# Altium schematic sheet PCB Esquematic.SchDoc
size A1
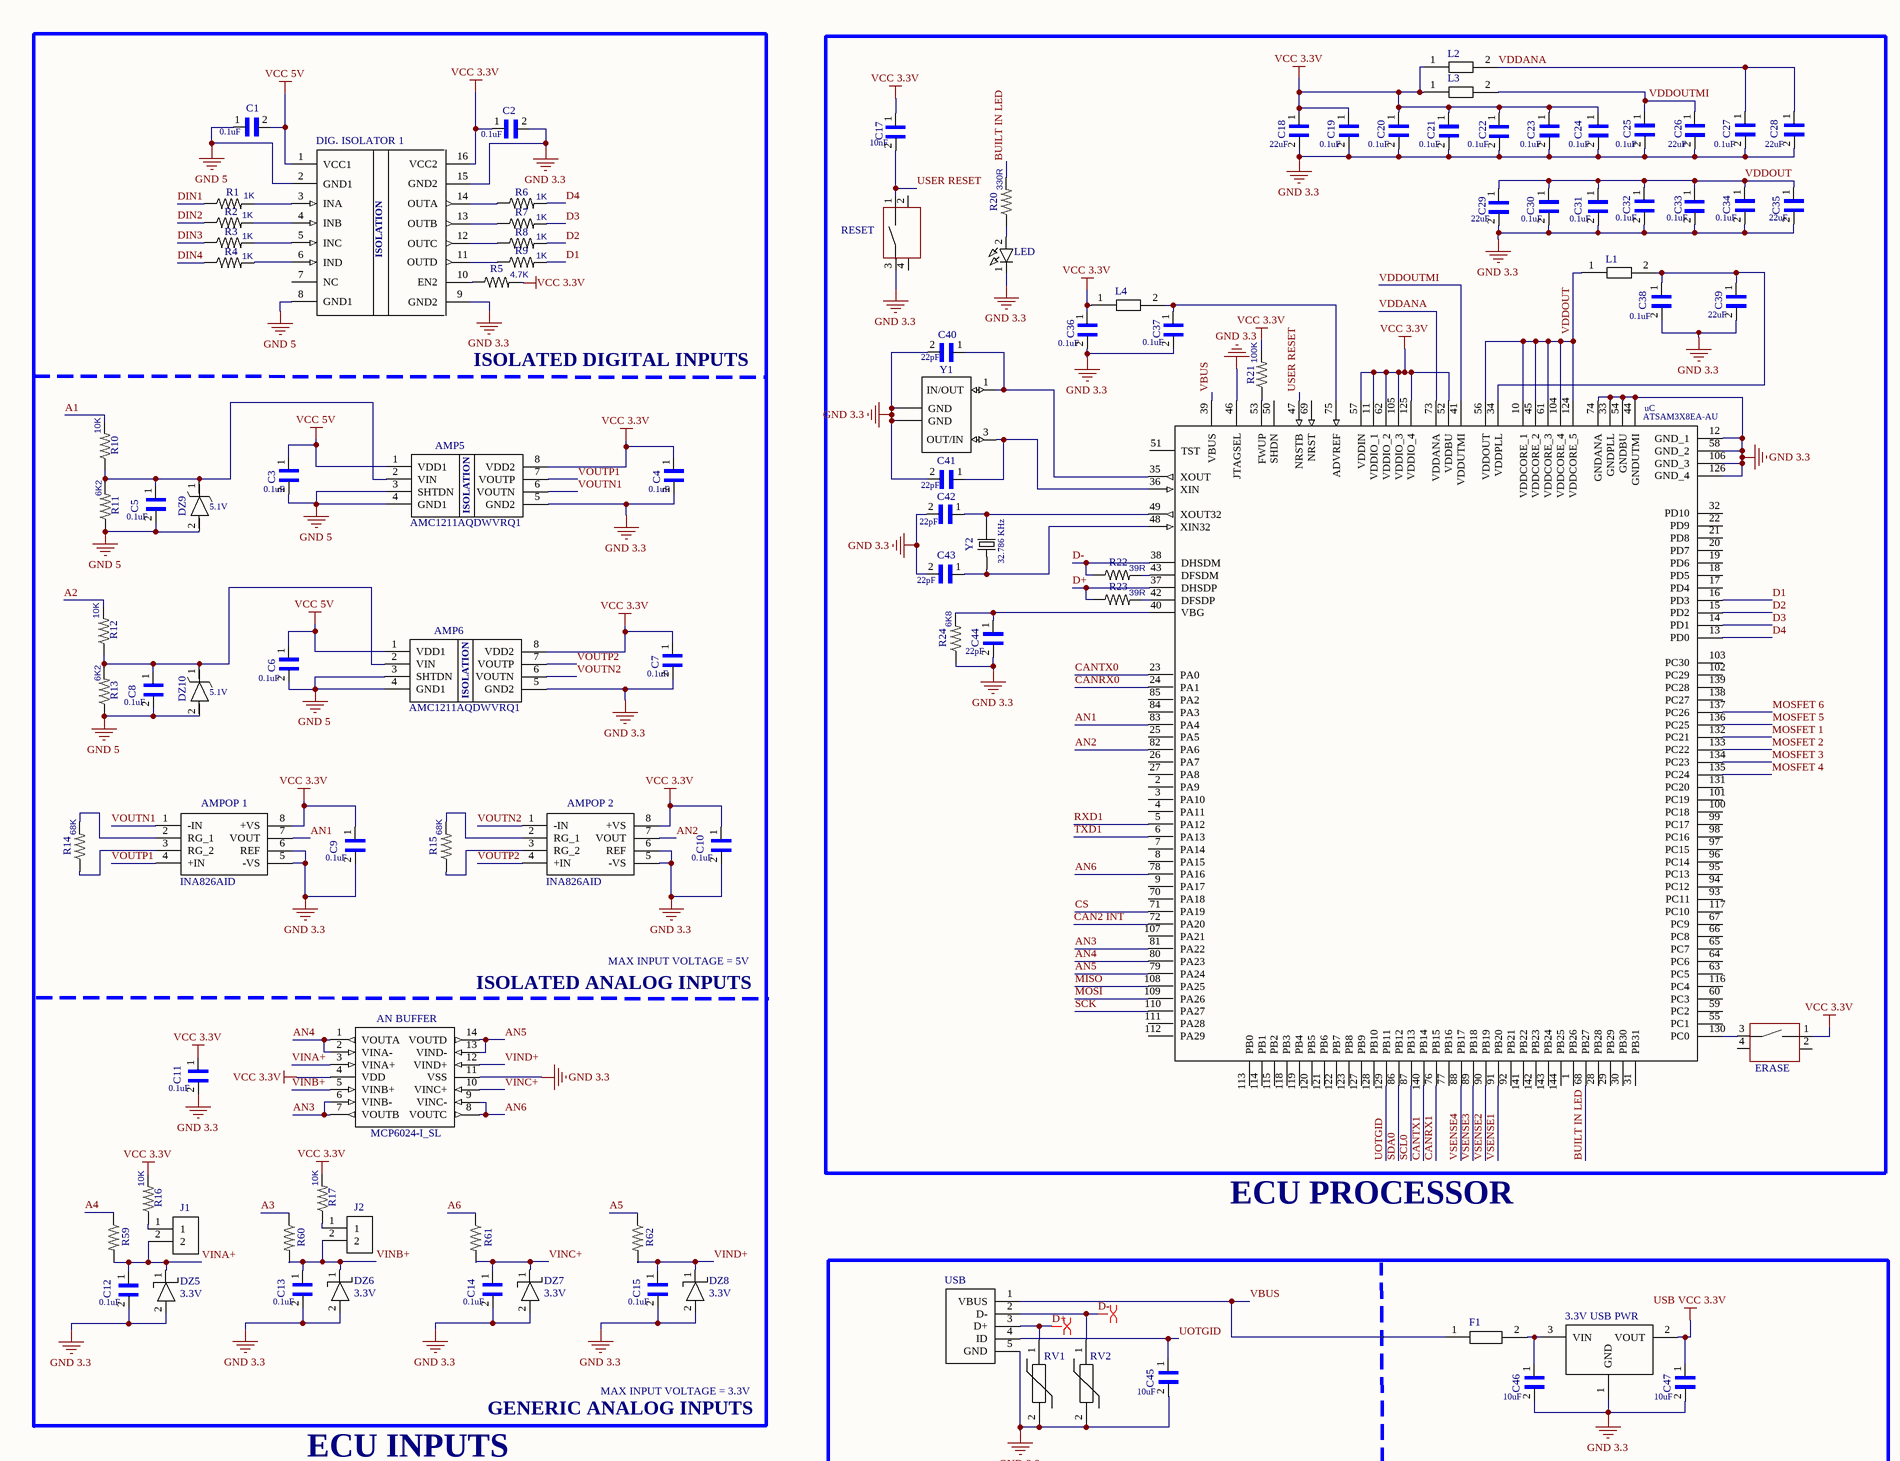
[diagram p0: PCB Esquematic.SchDoc, top left]
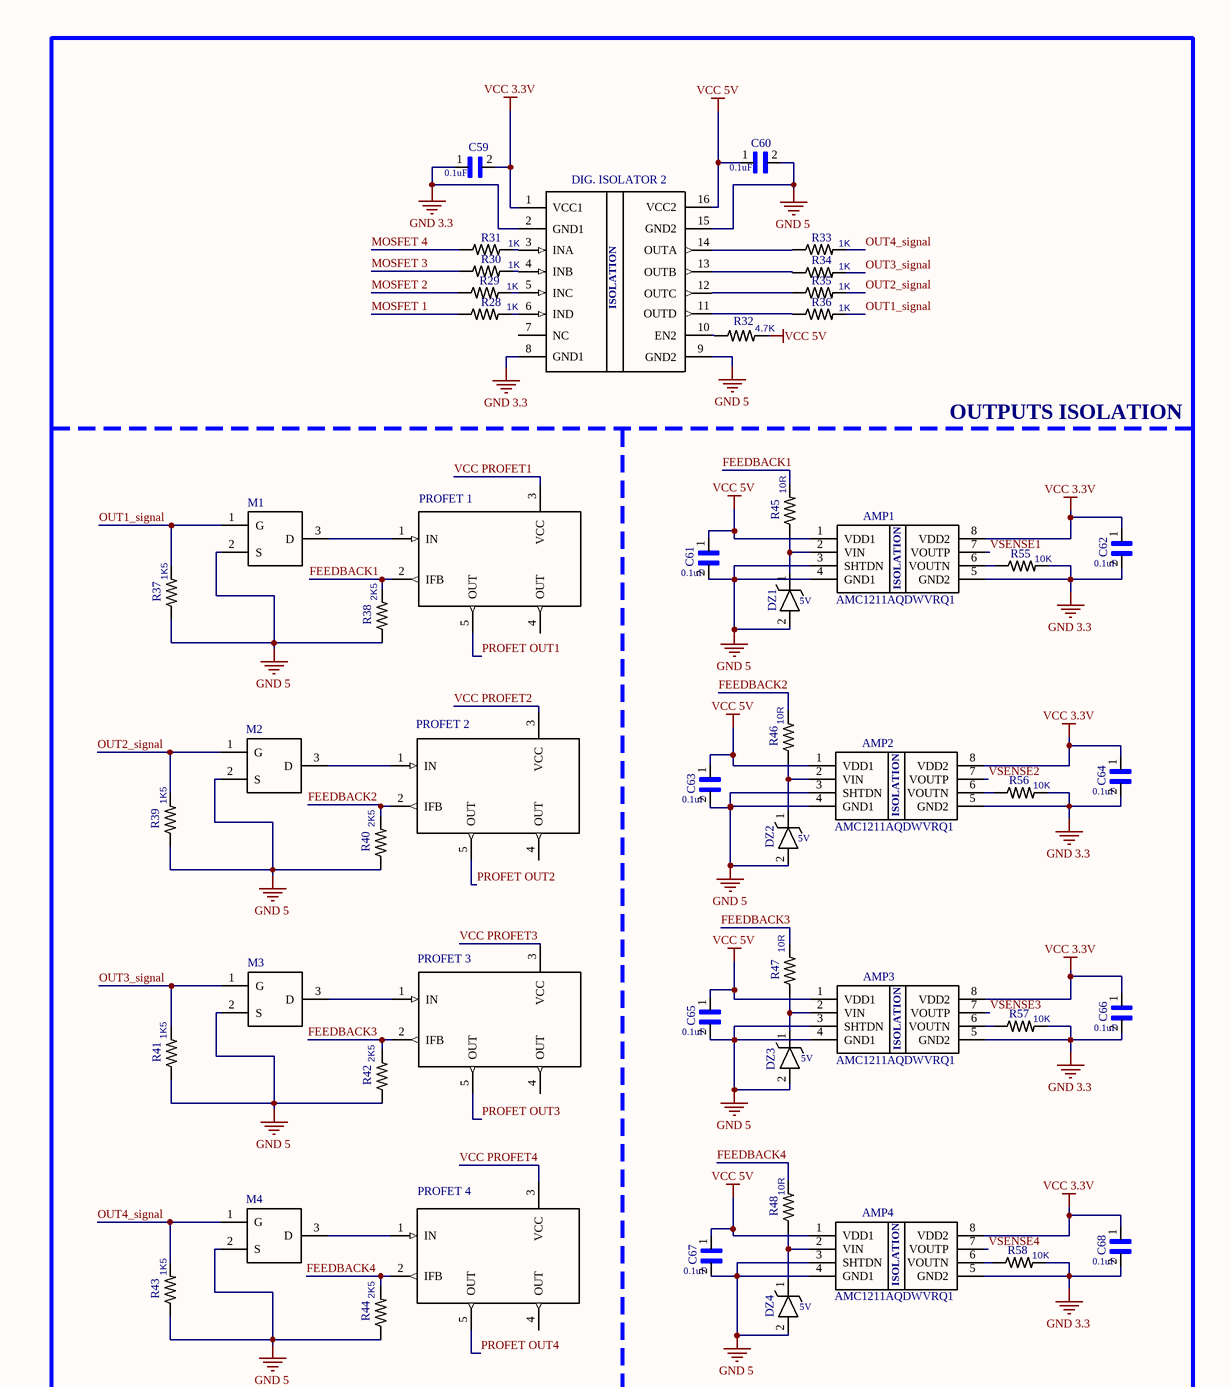
[diagram p1: PCB Esquematic.SchDoc, top right]
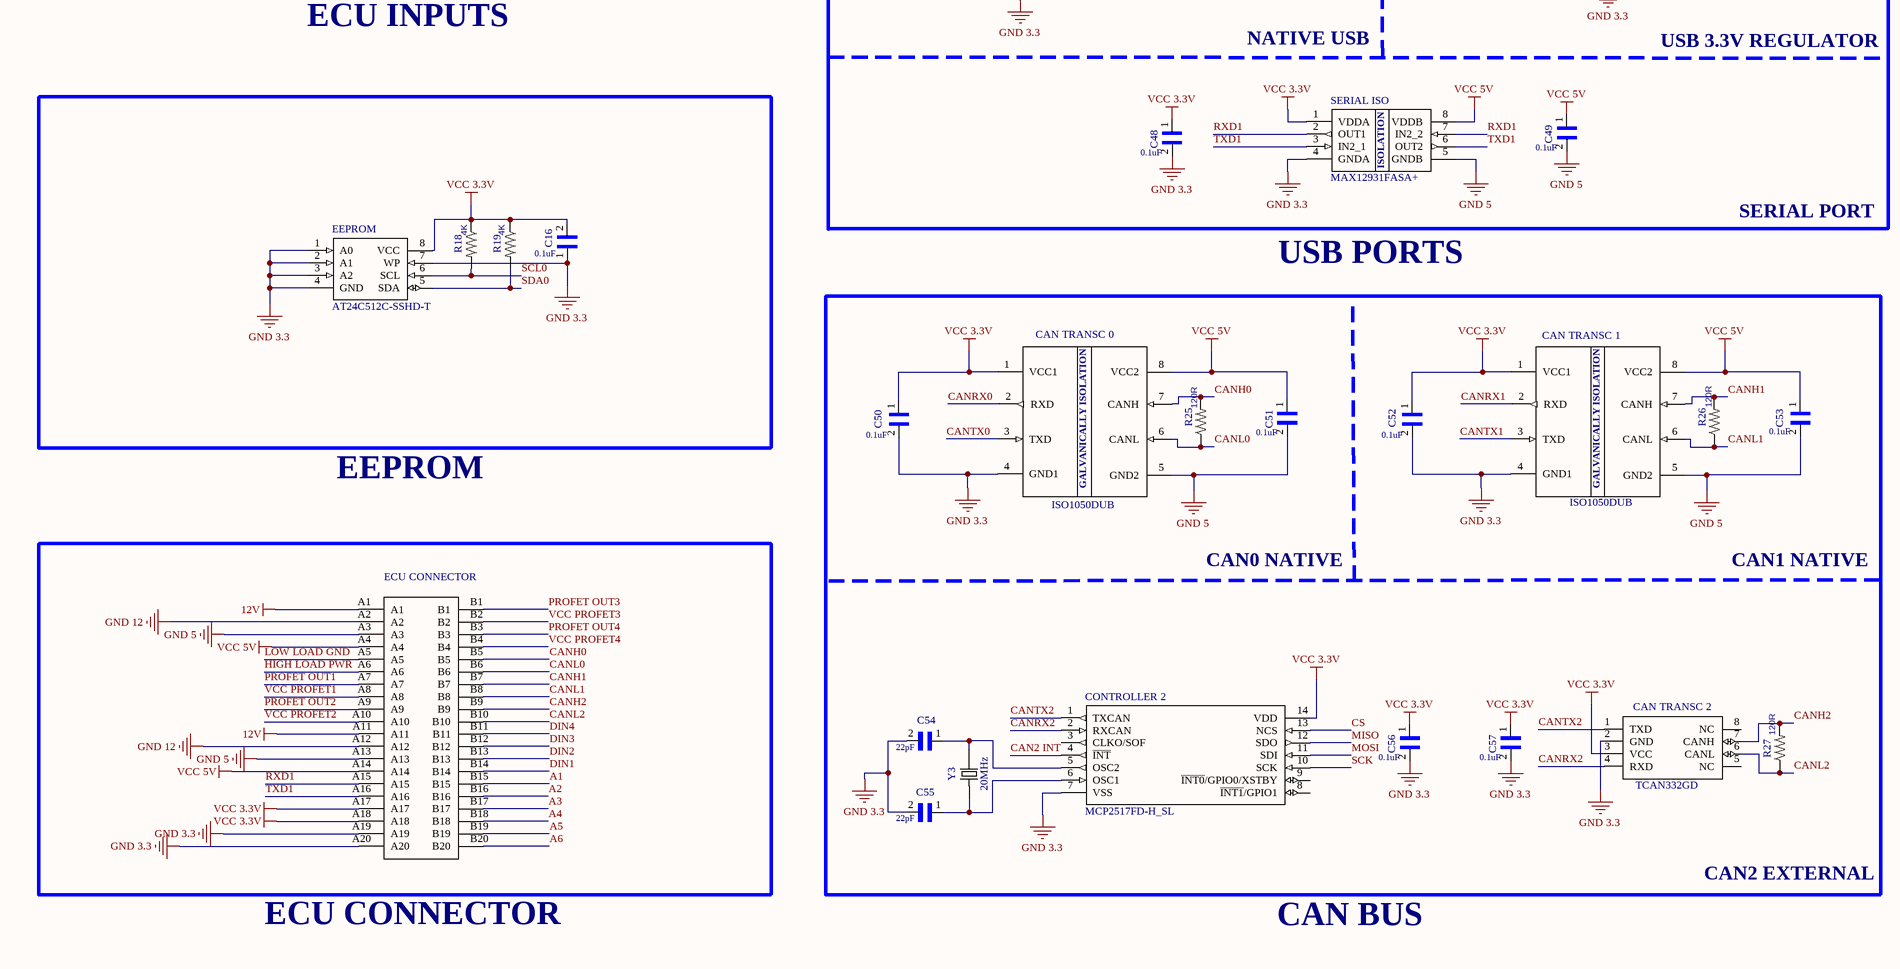
[diagram p2: PCB Esquematic.SchDoc, bottom left]
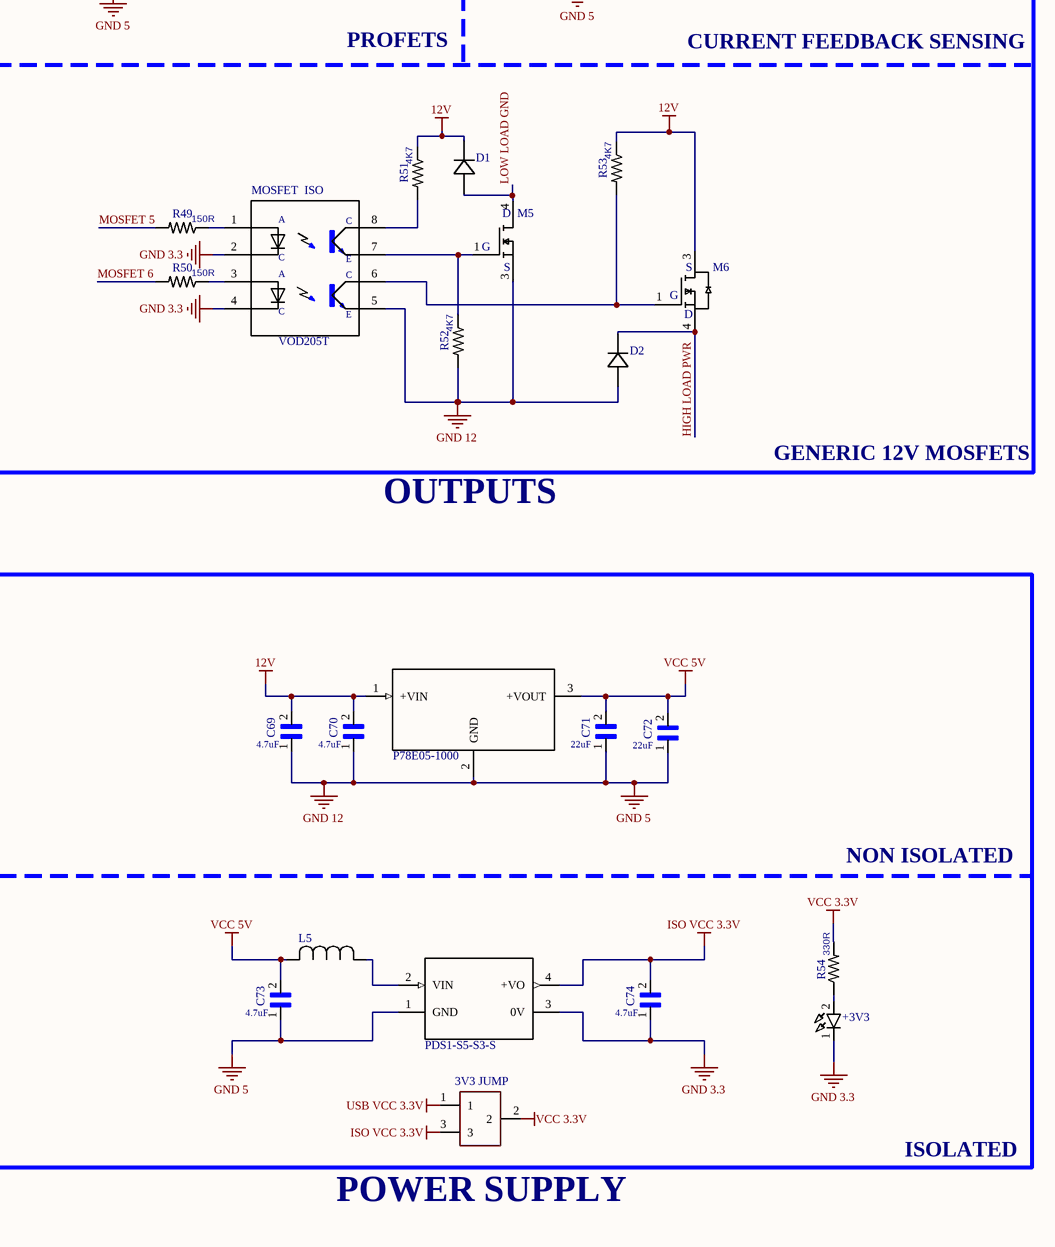
[diagram p3: PCB Esquematic.SchDoc, bottom right]

## Parts
3.3V_USB_PWR  ams1117-3.3v  [SOT229P700X180-4N]  (value not drawn)
3V3_JUMP  5-146274-3  [TE_5-146274-3]  (value not drawn)
+3V3  150080GS75000  [LEDM2012X80N]  (value not drawn)
AMP1  AMC1211AQDWVRQ1  [SOIC127P1150X280-8N]
AMP2  AMC1211AQDWVRQ1  [SOIC127P1150X280-8N]
AMP3  AMC1211AQDWVRQ1  [SOIC127P1150X280-8N]
AMP4  AMC1211AQDWVRQ1  [SOIC127P1150X280-8N]
AMP5  AMC1211AQDWVRQ1  [SOIC127P1150X280-8N]
AMP6  AMC1211AQDWVRQ1  [SOIC127P1150X280-8N]
AMPOP_1  INA826AID  [SOIC127P600X175-8N]
AMPOP_2  INA826AID  [SOIC127P600X175-8N]
AN_BUFFER  MCP6024-I_SL  [SOIC127P600X175-14N]
C1  0.1uF  [CAPC2012X100N]
C2  0.1uF  [CAPC2012X100N]
C3  0.1uF  [*CAPC320160X94]
C4  0.1uF  [*CAPC320160X94]
C5  0.1uF  [CAPC2012X100N]
C6  0.1uF  [*CAPC320160X94]
C7  0.1uF  [*CAPC320160X94]
C8  0.1uF  [CAPC2012X100N]
C9  0.1uF  [CAPC2012X100N]
C10  0.1uF  [CAPC2012X100N]
C11  0.1uF  [CAPC2012X100N]
C12  0.1uF  [CAPC2012X100N]
C13  0.1uF  [CAPC2012X100N]
C14  0.1uF  [CAPC2012X100N]
C15  0.1uF  [CAPC2012X100N]
C16  0.1uF  [CAPC2012X100N]
C17  10nF  [CAPC2012X100N]
C18  22uF  [CAPC2012X100N]
C19  0.1uF  [CAPC2012X100N]
C20  0.1uF  [CAPC2012X100N]
C21  0.1uF  [CAPC2012X100N]
C22  0.1uF  [CAPC2012X100N]
C23  0.1uF  [CAPC2012X100N]
C24  0.1uF  [CAPC2012X100N]
C25  0.1uF  [CAPC2012X100N]
C26  22uF  [CAPC2012X100N]
C27  0.1uF  [CAPC2012X100N]
C28  22uF  [CAPC2012X100N]
C29  22uF  [CAPC2012X100N]
C30  0.1uF  [CAPC2012X100N]
C31  0.1uF  [CAPC2012X100N]
C32  0.1uF  [CAPC2012X100N]
C33  0.1uF  [CAPC2012X100N]
C34  0.1uF  [CAPC2012X100N]
C35  22uF  [CAPC2012X100N]
C36  0.1uF  [CAPC2012X100N]
C37  0.1uF  [CAPC2012X100N]
C38  0.1uF  [CAPC2012X100N]
C39  22uF  [CAPC2012X100N]
C40  22pF  [CAPC2012X100N]
C41  22pF  [CAPC2012X100N]
C42  22pF  [CAPC2012X100N]
C43  22pF  [CAPC2012X100N]
C44  22pF  [CAPC2012X100N]
C45  10uF  [CAPC2012X100N]
C46  10uF  [CAPC2012X100N]
C47  10uF  [CAPC2012X100N]
C48  0.1uF  [CAPC2012X100N]
C49  0.1uF  [CAPC2012X100N]
C50  0.1uF  [CAPC2012X100N]
C51  0.1uF  [CAPC2012X100N]
C52  0.1uF  [CAPC2012X100N]
C53  0.1uF  [CAPC2012X100N]
C54  22pF  [CAPC2012X100N]
C55  22pF  [CAPC2012X100N]
C56  0.1uF  [CAPC2012X100N]
C57  0.1uF  [CAPC2012X100N]
C59  0.1uF  [CAPC2012X100N]
C60  0.1uF  [CAPC2012X100N]
C61  0.1uF  [*CAPC320160X94]
C62  0.1uF  [*CAPC320160X94]
C63  0.1uF  [*CAPC320160X94]
C64  0.1uF  [*CAPC320160X94]
C65  0.1uF  [*CAPC320160X94]
C66  0.1uF  [*CAPC320160X94]
C67  0.1uF  [*CAPC320160X94]
C68  0.1uF  [*CAPC320160X94]
C69  4.7uF  [CAPC2012X100N]
C70  4.7uF  [CAPC2012X100N]
C71  22uF  [CAPC2012X100N]
C72  22uF  [CAPC2012X100N]
C73  4.7uF  [CAPC2012X100N]
C74  4.7uF  [CAPC2012X100N]
CAN_TRANSC_0  ISO1050DUB  [SOP254P1040X485-8N]
CAN_TRANSC_1  ISO1050DUB  [SOP254P1040X485-8N]
CAN_TRANSC_2  TCAN332GD  [SOIC127P600X175-8N]
CONTROLLER_2  MCP2517FD-H_SL  [SOIC127P600X175-14N]
D1  S2KDFQ-13  [SMC-M]  (value not drawn)
D2  S2KDFQ-13  [SMC-M]  (value not drawn)
DIG._ISOLATOR_1  Component_1  [SOIC127P1032X265-16N]  (value not drawn)
DIG._ISOLATOR_2  Component_1  [SOIC127P1032X265-16N]  (value not drawn)
DZ1  5V  [DIOM5026X220N]
DZ2  5V  [DIOM5026X220N]
DZ3  5V  [DIOM5026X220N]
DZ4  5V  [DIOM5026X220N]
DZ5  3.3V  [DIOM5226X220N]
DZ6  3.3V  [DIOM5226X220N]
DZ7  3.3V  [DIOM5226X220N]
DZ8  3.3V  [DIOM5226X220N]
DZ9  5.1V  [DIOM5026X220N]
DZ10  5.1V  [DIOM5026X220N]
ECU_CONNECTOR  5810140011  [5810140011]  (value not drawn)
EEPROM  AT24C512C-SSHD-T  [ATSOIC127P600X175-8N]
ERASE  5-1437565-0  [SW_5-1437565-0]  (value not drawn)
F1  MF-MSMF050-2  [FUSC4632X85N]  (value not drawn)
J1  5-146274-2  [TE_5-146274-2]  (value not drawn)
J2  5-146274-2  [TE_5-146274-2]  (value not drawn)
L1  MH2029-300Y  [BEADC2016X130N]  (value not drawn)
L2  MH2029-300Y  [BEADC2016X130N]  (value not drawn)
L3  MH2029-300Y  [BEADC2016X130N]  (value not drawn)
L4  MH2029-300Y  [BEADC2016X130N]  (value not drawn)
L5  SDR0302-6R8ML  [IND_BOURNS_SDR03]  (value not drawn)
LED  150080GS75000  [LEDM2012X80N]  (value not drawn)
M1  BSS138  [SOT95P240X120-3N]  (value not drawn)
M2  BSS138  [SOT95P240X120-3N]  (value not drawn)
M3  BSS138  [SOT95P240X120-3N]  (value not drawn)
M4  BSS138  [SOT95P240X120-3N]  (value not drawn)
M5  NVD5C454NT4G  [DPAK_(SINGLE-GAUGE)_TO-252(369C)_ISSUE_F]  (value not drawn)
M6  HS_MOSFET  [DPAK_HS MOSFET]  (value not drawn)
MOSFET_ISO  VOD205T  [*SOIC127P610X331-8N]
PROFET_1  LM2576D2TR4-5G  [D2PAK-5]  (value not drawn)
PROFET_2  LM2576D2TR4-5G  [D2PAK-5]  (value not drawn)
PROFET_3  LM2576D2TR4-5G  [D2PAK-5]  (value not drawn)
PROFET_4  LM2576D2TR4-5G  [D2PAK-5]  (value not drawn)
R1  1K  [RESC2012X65N]
R2  1K  [RESC2012X65N]
R3  1K  [RESC2012X65N]
R4  1K  [RESC2012X65N]
R5  4.7K  [RESC2012X65N]
R6  1K  [RESC2012X65N]
R7  1K  [RESC2012X65N]
R8  1K  [RESC2012X65N]
R9  1K  [RESC2012X65N]
R10  10K  [RESC2012X65N]
R11  6K2  [RESC2012X65N]
R12  10K  [RESC2012X65N]
R13  6K2  [RESC2012X65N]
R14  68K  [RESC2012X65N]
R15  68K  [RESC2012X65N]
R16  10K  [RESC2012X65N]
R17  10K  [RESC2012X65N]
R18  4K  [RESC2012X65N]
R19  4K  [RESC2012X65N]
R20  330R  [RESC2012X65N]
R21  100K  [RESC2012X65N]
R22  39R  [RESC2012X65N]
R23  39R  [RESC2012X65N]
R24  6K8  [RESC2012X65N]
R25  120R  [RESC2012X65N]
R26  120R  [RESC2012X65N]
R27  120R  [RESC2012X65N]
R28  1K  [RESC2012X65N]
R29  1K  [RESC2012X65N]
R30  1K  [RESC2012X65N]
R31  1K  [RESC2012X65N]
R32  4.7K  [RESC2012X65N]
R33  1K  [RESC2012X65N]
R34  1K  [RESC2012X65N]
R35  1K  [RESC2012X65N]
R36  1K  [RESC2012X65N]
R37  1K5  [RESC2012X65N]
R38  2K5  [RESC2012X65N]
R39  1K5  [RESC2012X65N]
R40  2K5  [RESC2012X65N]
R41  1K5  [RESC2012X65N]
R42  2K5  [RESC2012X65N]
R43  1K5  [RESC2012X65N]
R44  2K5  [RESC2012X65N]
R45  10R  [RESC2012X65N]
R46  10R  [RESC2012X65N]
R47  10R  [RESC2012X65N]
R48  10R  [RESC2012X65N]
R49  150R  [RESC2012X65N]
R50  150R  [RESC2012X65N]
R51  4K7  [RESC2012X65N]
R52  4K7  [RESC2012X65N]
R53  4K7  [RESC2012X65N]
R54  330R  [RESC2012X65N]
R55  10K  [RESC2012X65N]
R56  10K  [RESC2012X65N]
R57  10K  [RESC2012X65N]
R58  10K  [RESC2012X65N]
R59  10K  [RESC2012X65N]  (value not drawn)
R60  10K  [RESC2012X65N]  (value not drawn)
R61  10K  [RESC2012X65N]  (value not drawn)
R62  10K  [RESC2012X65N]  (value not drawn)
RESET  5-1437565-0  [SW_5-1437565-0]  (value not drawn)
RV1  CG0603MLC-05E  [VARC1608X55N]  (value not drawn)
RV2  CG0603MLC-05E  [VARC1608X55N]  (value not drawn)
SERIAL_ISO  MAX12931FASA+  [MAXSOIC127P600X175-8N]
uC  ATSAM3X8EA-AU  [QFP50P2200X2200X160-144N]
USB  1734035-4  [1734035-2USB]  (value not drawn)
V._REGULATOR_3V3  PDS1-S5-S3-S  [*CONV_PDS1-S5-S3-S]
V._REGULATOR_5V  P78E05-1000  [*CONV_P78E05-1000]
Y1  ECS-120-12-33Q-JES-TR  [XTAL_ECS-120-12-33Q-JES-TR]  (value not drawn)
Y2  32.786 KHz  [XTAL_ECS-.327-9-39-TR]
Y3  20MHz  [XTAL_ECS-080-18-23G-JGN-TR]

## Nets
12V: C69.2 C70.2 D1.1 ECU_CONNECTOR.A1 ECU_CONNECTOR.A11 M6.3(S) R51.1 R53.1 V._REGULATOR_5V.1(+VIN)
GND 3.3: 3.3V_USB_PWR.1(GND) +3V3.1(K) AMP1.5(GND2) AMP2.5(GND2) AMP3.5(GND2) AMP4.5(GND2) AMP5.5(GND2) AMP6.5(GND2) AMPOP_1.5(-VS) AMPOP_1.6(REF) AMPOP_2.5(-VS) AMPOP_2.6(REF) AN_BUFFER.11(VSS) C2.2 C4.2 C7.2 C9.2 C10.2 C11.2 C12.2 C13.2 C14.2 C15.2 C16.1 C18.2 C19.2 C20.2 C21.2 C22.2 C23.2 C24.2 C25.2 C26.2 C27.2 C28.2 C29.2 C30.2 C31.2 C32.2 C33.2 C34.2 C35.2 C36.2 C37.2 C38.2 C39.2 C40.2 C41.2 C42.2 C43.2 C44.2 C45.2 C46.2 C47.2 C48.2 C50.2 C52.2 C54.2 C55.2 C56.2 C57.2 C59.1 C62.2 C64.2 C66.2 C68.2 C74.1 CAN_TRANSC_0.4(GND1) CAN_TRANSC_1.4(GND1) CAN_TRANSC_2.2(GND) CONTROLLER_2.7(VSS) DIG._ISOLATOR_1.9(GND2) DIG._ISOLATOR_1.15(GND2) DIG._ISOLATOR_2.2(GND1) DIG._ISOLATOR_2.8(GND1) DZ5.2(A) DZ6.2(A) DZ7.2(A) DZ8.2(A) ECU_CONNECTOR.A19 ECU_CONNECTOR.A20 EEPROM.1(A0) EEPROM.2(A1) EEPROM.3(A2) EEPROM.4(GND) EEPROM.7(WP) LED.1(K) MOSFET_ISO.2(C1) MOSFET_ISO.4(C2) R24.1 R55.2 R56.2 R57.2 R58.2 RESET.3 RV1.2 RV2.2 SERIAL_ISO.4(GNDA) uC.12(GND_1) uC.33(GNDPLL) uC.44(GNDUTMI) uC.46(JTAGSEL) uC.54(GNDBU) uC.58(GND_2) uC.74(GNDANA) uC.106(GND_3) uC.126(GND_4) USB.5(GND) V._REGULATOR_3V3.3(0V) Y1.2(GND) Y1.4(GND)
GND 12: AMP1.3(SHTDN) AMP1.4(GND1) AMP2.3(SHTDN) AMP2.4(GND1) AMP3.3(SHTDN) AMP3.4(GND1) AMP4.3(SHTDN) AMP4.4(GND1) AMP5.3(SHTDN) AMP5.4(GND1) AMP6.3(SHTDN) AMP6.4(GND1) C1.1 C3.2 C5.2 C6.2 C8.2 C49.2 C51.2 C53.2 C60.2 C61.2 C63.2 C65.2 C67.2 C69.1 C70.1 C71.1 C72.1 C73.1 CAN_TRANSC_0.5(GND2) CAN_TRANSC_1.5(GND2) D2.2 DIG._ISOLATOR_1.2(GND1) DIG._ISOLATOR_1.8(GND1) DIG._ISOLATOR_2.9(GND2) DIG._ISOLATOR_2.15(GND2) DZ1.2(A) DZ2.2(A) DZ3.2(A) DZ4.2(A) DZ9.2(A) DZ10.2(A) ECU_CONNECTOR.A2 ECU_CONNECTOR.A3 ECU_CONNECTOR.A12 ECU_CONNECTOR.A13 M1.2(S) M2.2(S) M3.2(S) M4.2(S) M5.3(S) MOSFET_ISO.5(E1) R11.1 R13.1 R37.1 R38.1 R39.1 R40.1 R41.1 R42.1 R43.1 R44.1 R52.2 SERIAL_ISO.5(GNDB) V._REGULATOR_3V3.1(GND) V._REGULATOR_5V.2(GND)  [also labelled GND 5]
ISO VCC 3.3V: 3V3_JUMP.3 C74.2 V._REGULATOR_3V3.4(+VO)
USB VCC 3.3V: 3.3V_USB_PWR.2(VOUT) 3V3_JUMP.1 C47.1
VCC 3.3V: 3V3_JUMP.2 AMP1.8(VDD2) AMP2.8(VDD2) AMP3.8(VDD2) AMP4.8(VDD2) AMP5.8(VDD2) AMP6.8(VDD2) AMPOP_1.8(+VS) AMPOP_2.8(+VS) AN_BUFFER.4(VDD) C2.1 C4.1 C7.1 C9.1 C10.1 C11.1 C16.2 C17.1 C18.1 C19.1 C20.1 C21.1 C22.1 C23.1 C24.1 C36.1 C48.1 C50.1 C52.1 C56.1 C57.1 C59.2 C62.1 C64.1 C66.1 C68.1 CAN_TRANSC_0.1(VCC1) CAN_TRANSC_1.1(VCC1) CAN_TRANSC_2.3(VCC) CONTROLLER_2.14(VDD) DIG._ISOLATOR_1.16(VCC2) DIG._ISOLATOR_2.1(VCC1) ECU_CONNECTOR.A17 ECU_CONNECTOR.A18 EEPROM.8(VCC) ERASE.1 L2.1 L3.1 L4.1 R5.2 R16.2 R17.2 R18.1 R19.1 R21.2 R54.2 SERIAL_ISO.1(VDDA) uC.11(VDDIO_1) uC.52(VDDBU) uC.57(VDDIN) uC.62(VDDIO_2) uC.105(VDDIO_3) uC.125(VDDIO_4)
VCC 5V: AMP1.1(VDD1) AMP2.1(VDD1) AMP3.1(VDD1) AMP4.1(VDD1) AMP5.1(VDD1) AMP6.1(VDD1) C1.2 C3.1 C6.1 C49.1 C51.1 C53.1 C60.1 C61.1 C63.1 C65.1 C67.1 C71.2 C72.2 C73.2 CAN_TRANSC_0.8(VCC2) CAN_TRANSC_1.8(VCC2) DIG._ISOLATOR_1.1(VCC1) DIG._ISOLATOR_2.16(VCC2) ECU_CONNECTOR.A4 ECU_CONNECTOR.A14 L5.2 R32.2 SERIAL_ISO.8(VDDB) V._REGULATOR_5V.3(+VOUT)
A1: ECU_CONNECTOR.B15 R10.2
A2: ECU_CONNECTOR.B16 R12.2
A3: ECU_CONNECTOR.B17 R60.1
A4: ECU_CONNECTOR.B18 R59.1
A5: ECU_CONNECTOR.B19 R62.1
A6: ECU_CONNECTOR.B20 R61.1
AN1: AMPOP_1.7(VOUT) uC.83(PA4)
AN2: AMPOP_2.7(VOUT) uC.82(PA6)
AN3: AN_BUFFER.6(VINB-) AN_BUFFER.7(VOUTB) uC.81(PA22)
AN4: AN_BUFFER.1(VOUTA) AN_BUFFER.2(VINA-) uC.80(PA23)
AN5: AN_BUFFER.13(VIND-) AN_BUFFER.14(VOUTD) uC.79(PA24)
AN6: AN_BUFFER.8(VOUTC) AN_BUFFER.9(VINC-) uC.78(PA16)
BUILT IN LED: R20.2 uC.68(PB27)
CAN2 INT: CONTROLLER_2.4(~{INT}) uC.72(PA20)
CANH0: CAN_TRANSC_0.7(CANH) ECU_CONNECTOR.B5 R25.2
CANH1: CAN_TRANSC_1.7(CANH) ECU_CONNECTOR.B7 R26.2
CANH2: CAN_TRANSC_2.7(CANH) ECU_CONNECTOR.B9 R27.2
CANL0: CAN_TRANSC_0.6(CANL) ECU_CONNECTOR.B6 R25.1
CANL1: CAN_TRANSC_1.6(CANL) ECU_CONNECTOR.B8 R26.1
CANL2: CAN_TRANSC_2.6(CANL) ECU_CONNECTOR.B10 R27.1
CANRX0: CAN_TRANSC_0.2(RXD) uC.24(PA1)
CANRX1: CAN_TRANSC_1.2(RXD) uC.76(PB15)
CANRX2: CAN_TRANSC_2.4(RXD) CONTROLLER_2.2(RXCAN)
CANTX0: CAN_TRANSC_0.3(TXD) uC.23(PA0)
CANTX1: CAN_TRANSC_1.3(TXD) uC.140(PB14)
CANTX2: CAN_TRANSC_2.1(TXD) CONTROLLER_2.1(TXCAN)
CS: CONTROLLER_2.13(NCS) uC.71(PA19)
D1: R9.2 uC.16(PD3)
D2: R8.2 uC.15(PD2)
D3: R7.2 uC.14(PD1)
D4: R6.2 uC.13(PD0)
D+: R23.1 RV1.1 uC.37(DHSDP) USB.3(D+)
D-: R22.1 RV2.1 uC.38(DHSDM) USB.2(D-)
DIN1: ECU_CONNECTOR.B14 R1.1
DIN2: ECU_CONNECTOR.B13 R2.1
DIN3: ECU_CONNECTOR.B12 R3.1
DIN4: ECU_CONNECTOR.B11 R4.1
FEEDBACK1: PROFET_1.2(IFB) R38.2 R45.2
FEEDBACK2: PROFET_2.2(IFB) R40.2 R46.2
FEEDBACK3: PROFET_3.2(IFB) R42.2 R47.2
FEEDBACK4: PROFET_4.2(IFB) R44.2 R48.2
HIGH LOAD PWR: D2.1 ECU_CONNECTOR.A6 M6.4(D_TAB)
LOW LOAD GND: D1.2 ECU_CONNECTOR.A5 M5.4(D)
MISO: CONTROLLER_2.12(SDO) uC.108(PA25)
MOSFET 1: R28.1 uC.132(PC21)
MOSFET 2: R29.1 uC.133(PC22)
MOSFET 3: R30.1 uC.134(PC23)
MOSFET 4: R31.1 uC.135(PC24)
MOSFET 5: R49.2 uC.136(PC25)
MOSFET 6: R50.2 uC.137(PC26)
MOSI: CONTROLLER_2.11(SDI) uC.109(PA26)
OUT1_signal: M1.1(G) R36.2 R37.2
OUT2_signal: M2.1(G) R35.2 R39.2
OUT3_signal: M3.1(G) R34.2 R41.2
OUT4_signal: M4.1(G) R33.2 R43.2
PROFET OUT1: ECU_CONNECTOR.A7 PROFET_1.5(OUT)
PROFET OUT2: ECU_CONNECTOR.A9 PROFET_2.5(OUT)
PROFET OUT3: ECU_CONNECTOR.B1 PROFET_3.5(OUT)
PROFET OUT4: ECU_CONNECTOR.B3 PROFET_4.5(OUT)
RXD1: ECU_CONNECTOR.A15 SERIAL_ISO.2(OUT1) SERIAL_ISO.7(IN2_2) uC.5(PA12)
SCK: CONTROLLER_2.10(SCK) uC.110(PA27)
SCL0: EEPROM.6(SCL) R18.2 uC.87(PB13)
SDA0: EEPROM.5(SDA) R19.2 uC.86(PB12)
TXD1: ECU_CONNECTOR.A16 SERIAL_ISO.3(IN2_1) SERIAL_ISO.6(OUT2) uC.6(PA13)
UOTGID: C45.1 uC.129(PB11) USB.4(ID)
USER RESET: C17.2 RESET.1 uC.47(NRSTB)
VBUS: F1.1 uC.39(VBUS) USB.1(VBUS)
VCC PROFET1: ECU_CONNECTOR.A8 PROFET_1.3(VCC)
VCC PROFET2: ECU_CONNECTOR.A10 PROFET_2.3(VCC)
VCC PROFET3: ECU_CONNECTOR.B2 PROFET_3.3(VCC)
VCC PROFET4: ECU_CONNECTOR.B4 PROFET_4.3(VCC)
VDDANA: C27.1 C28.1 L2.2 uC.73(VDDANA)
VDDOUT: C29.1 C30.1 C31.1 C32.1 C33.1 C34.1 C35.1 L1.1 uC.10(VDDCORE_1) uC.45(VDDCORE_2) uC.56(VDDOUT) uC.61(VDDCORE_3) uC.104(VDDCORE_4) uC.124(VDDCORE_5)
VDDOUTMI: C25.1 C26.1 L3.2 uC.41(VDDUTMI)
VINA+: AN_BUFFER.3(VINA+) C12.1 DZ5.1(K) J1.2 R59.2
VINB+: AN_BUFFER.5(VINB+) C13.1 DZ6.1(K) J2.2 R60.2
VINC+: AN_BUFFER.10(VINC+) C14.1 DZ7.1(K) R61.2
VIND+: AN_BUFFER.12(VIND+) C15.1 DZ8.1(K) R62.2
VOUTN1: AMP5.6(VOUTN) AMPOP_1.1(-IN)
VOUTN2: AMP6.6(VOUTN) AMPOP_2.1(-IN)
VOUTP1: AMP5.7(VOUTP) AMPOP_1.4(+IN)
VOUTP2: AMP6.7(VOUTP) AMPOP_2.4(+IN)
VSENSE1: AMP1.7(VOUTP) uC.91(PB20)
VSENSE2: AMP2.7(VOUTP) uC.90(PB19)
VSENSE3: AMP3.7(VOUTP) uC.89(PB18)
VSENSE4: AMP4.7(VOUTP) uC.88(PB17)
Net3.3V_USB_PWR_3: 3.3V_USB_PWR.3(VIN) C46.1 F1.2
Net+3V3_2: +3V3.2(A) R54.1
NetAMP1_2: AMP1.2(VIN) DZ1.1(K) R45.1
NetAMP1_6: AMP1.6(VOUTN) R55.1
NetAMP2_2: AMP2.2(VIN) DZ2.1(K) R46.1
NetAMP2_6: AMP2.6(VOUTN) R56.1
NetAMP3_2: AMP3.2(VIN) DZ3.1(K) R47.1
NetAMP3_6: AMP3.6(VOUTN) R57.1
NetAMP4_2: AMP4.2(VIN) DZ4.1(K) R48.1
NetAMP4_6: AMP4.6(VOUTN) R58.1
NetAMP5_2: AMP5.2(VIN) C5.1 DZ9.1(K) R10.1 R11.2
NetAMP6_2: AMP6.2(VIN) C8.1 DZ10.1(K) R12.1 R13.2
NetAMPOP_1_2: AMPOP_1.2(RG_1) R14.2
NetAMPOP_1_3: AMPOP_1.3(RG_2) R14.1
NetAMPOP_2_2: AMPOP_2.2(RG_1) R15.2
NetAMPOP_2_3: AMPOP_2.3(RG_2) R15.1
NetC37_1: C37.1 L4.2 uC.75(ADVREF)
NetC38_1: C38.1 C39.1 L1.2 uC.34(VDDPLL)
NetC40_1: C40.1 uC.35(XOUT) Y1.1(IN/OUT)
NetC41_1: C41.1 uC.36(XIN) Y1.3(OUT/IN)
NetC42_1: C42.1 uC.49(XOUT32) Y2.2
NetC43_1: C43.1 uC.48(XIN32) Y2.1
NetC44_1: C44.1 R24.2 uC.40(VBG)
NetC54_1: C54.1 CONTROLLER_2.5(OSC2) Y3.2
NetC55_1: C55.1 CONTROLLER_2.6(OSC1) Y3.1
NetDIG._ISOLATOR_1_3: DIG._ISOLATOR_1.3(INA) R1.2
NetDIG._ISOLATOR_1_4: DIG._ISOLATOR_1.4(INB) R2.2
NetDIG._ISOLATOR_1_5: DIG._ISOLATOR_1.5(INC) R3.2
NetDIG._ISOLATOR_1_6: DIG._ISOLATOR_1.6(IND) R4.2
NetDIG._ISOLATOR_1_10: DIG._ISOLATOR_1.10(EN2) R5.1
NetDIG._ISOLATOR_1_11: DIG._ISOLATOR_1.11(OUTD) R9.1
NetDIG._ISOLATOR_1_12: DIG._ISOLATOR_1.12(OUTC) R8.1
NetDIG._ISOLATOR_1_13: DIG._ISOLATOR_1.13(OUTB) R7.1
NetDIG._ISOLATOR_1_14: DIG._ISOLATOR_1.14(OUTA) R6.1
NetDIG._ISOLATOR_2_3: DIG._ISOLATOR_2.3(INA) R31.2
NetDIG._ISOLATOR_2_4: DIG._ISOLATOR_2.4(INB) R30.2
NetDIG._ISOLATOR_2_5: DIG._ISOLATOR_2.5(INC) R29.2
NetDIG._ISOLATOR_2_6: DIG._ISOLATOR_2.6(IND) R28.2
NetDIG._ISOLATOR_2_10: DIG._ISOLATOR_2.10(EN2) R32.1
NetDIG._ISOLATOR_2_11: DIG._ISOLATOR_2.11(OUTD) R36.1
NetDIG._ISOLATOR_2_12: DIG._ISOLATOR_2.12(OUTC) R35.1
NetDIG._ISOLATOR_2_13: DIG._ISOLATOR_2.13(OUTB) R34.1
NetDIG._ISOLATOR_2_14: DIG._ISOLATOR_2.14(OUTA) R33.1
NetERASE_3: ERASE.3 uC.130(PC0)
NetJ1_1: J1.1 R16.1
NetJ2_1: J2.1 R17.1
NetL5_1: L5.1 V._REGULATOR_3V3.2(VIN)
NetLED_2: LED.2(A) R20.1
NetM1_3: M1.3(D) PROFET_1.1(IN)
NetM2_3: M2.3(D) PROFET_2.1(IN)
NetM3_3: M3.3(D) PROFET_3.1(IN)
NetM4_3: M4.3(D) PROFET_4.1(IN)
NetM5_1: M5.1(G) MOSFET_ISO.7(E2) R52.1
NetM6_1: M6.1(G) MOSFET_ISO.6(CO1) R53.2
NetMOSFET_ISO_1: MOSFET_ISO.1(A1) R49.1
NetMOSFET_ISO_3: MOSFET_ISO.3(A2) R50.1
NetMOSFET_ISO_8: MOSFET_ISO.8(CO2) R51.2
NetR21_1: R21.1 uC.53(FWUP)
NetR22_2: R22.2 uC.43(DFSDM)
NetR23_2: R23.2 uC.42(DFSDP)

Not connected (* = marked no-connect by the designer): CAN_TRANSC_2 5(NC) 8(NC); CONTROLLER_2 3(CLKO/SOF) 8(~{INT1}/GPIO1) 9(~{INT0}/GPIO0/XSTBY); DIG._ISOLATOR_1 7(NC); DIG._ISOLATOR_2 7(NC); ERASE 2 4(1); PROFET_1 4(OUT); PROFET_2 4(OUT); PROFET_3 4(OUT); PROFET_4 4(OUT); RESET 2 4(1); uC 1(PB26) 2(PA9) 3(PA10) 4(PA11) 7(PA14) 8(PA15) 9(PA17) 17(PD4) 18(PD5) 19(PD6) 20(PD7) 21(PD8) 22(PD9) 25(PA5) 26(PA7) 27(PA8) 28(PB28) 29(PB29) 30(PB30) 31(PB31) 32(PD10) 50(SHDN) 51(TST) 55(PC1) 59(PC2) 60(PC3) 63(PC5) 64(PC6) 65(PC7) 66(PC8) 67(PC9) 69(NRST) 70(PA18) 77(PB16) 84(PA3) 85(PA2) 92(PB21) 93(PC11) 94(PC12) 95(PC13) 96(PC14) 97(PC15) 98(PC16) 99(PC17) 100(PC18) 101(PC19) 102(PC29) 103(PC30) 107(PA21) 111(PA28) 112(PA29) 113(PB0) 114(PB1) 115(PB2) 116(PC4) 117(PC10) 118(PB3) 119(PB4) 120(PB5) 121(PB6) 122(PB7) 123(PB8) 127(PB9) 128(PB10) 131(PC20) 138(PC27) 139(PC28) 141(PB22) 142(PB23) 143(PB24) 144(PB25)

## Layout directives
differential pair: D+, D-

## Notes on the sheet
- ISOLATED DIGITAL INPUTS
- OUTPUTS ISOLATION
- MAX INPUT VOLTAGE = 5V
- (near AN_BUFFER) ISOLATED ANALOG INPUTS
- ECU PROCESSOR
- PROFETS
- CURRENT FEEDBACK SENSING
- MAX INPUT VOLTAGE = 3.3V
- ECU INPUTS
- GENERIC ANALOG INPUTS
- NATIVE USB
- USB 3.3V REGULATOR
- SERIAL PORT
- USB PORTS
- GENERIC 12V MOSFETS
- OUTPUTS
- EEPROM
- CAN0 NATIVE
- CAN1 NATIVE
- NON ISOLATED
- CAN2 EXTERNAL
- ISOLATED
- ECU CONNECTOR
- CAN BUS
- (near 3V3_JUMP) POWER SUPPLY
- (in symbol AMC1211AQDWVRQ1) ISOLATION
- (in symbol Component_1) ISOLATION
- (in symbol HS_MOSFET) D
- (in symbol ISO1050DUB) GALVANICALLY ISOLATION
- (in symbol MAX12931FASA+) ISOLATION
- (in symbol VOD205T) A; C; E

## Library data of the parts
3.3V_USB_PWR = ams1117-3.3v: Integrated Circuit; Manufacturer_Name: Advanced Monolithic Systems; Datasheet Link: http://www.advanced-monolithic.com/pdf/ds1117.pdf; Height: 1.8mm; Manufacturer_Part_Number: ams1117-3.3v
3V3_JUMP = 5-146274-3: 03 MODII HDR SRST B/A .100CL; Centerline_Pitch: 2.54 mm[.1 in]; MF: TE Connectivity; Number_of_Positions: 3; Product_Type: Connector; Availability: Unavailable; Price: None; EU_RoHS_Compliance: Compliant; SnapEDA_Link: https://www.snapeda.com/parts/5-146274-3/TE%20Connectivity/view-part/?ref=snap; Link: http://www.te.com/usa-en/product-5-146274-3.html; Package: None; MP: 5-146274-3; Value: *
+3V3 LED = 150080GS75000: LED; Manufacturer_Name: Wurth Elektronik; Datasheet Link: https://katalog.we-online.com/led/datasheet/150080GS75000.pdf; Height: 0.8mm; Manufacturer_Part_Number: 150080GS75000; Mouser Part Number: 710-150080GS75000; Mouser Price/Stock: https://www.mouser.com/Search/Refine.aspx?Keyword=710-150080GS75000; RS Part Number: 1623746; RS Price/Stock: http://uk.rs-online.com/web/p/products/1623746
AMP1-AMP6 = AMC1211AQDWVRQ1: Integrated Circuit; Manufacturer_Name: Texas Instruments; Datasheet Link: http://www.ti.com/lit/gpn/amc1211-q1; Height: 2.8mm; Mouser Part Number: 595-AMC1211AQDWVRQ1; Mouser Price/Stock: https://www.mouser.com/Search/Refine.aspx?Keyword=595-AMC1211AQDWVRQ1; Manufacturer_Part_Number: AMC1211AQDWVRQ1
AMPOP_1 AMPOP_2 = INA826AID: Integrated Circuit; Manufacturer_Name: Texas Instruments; Datasheet Link: http://www.ti.com/lit/gpn/ina826; Height: 1.75mm; Manufacturer_Part_Number: INA826AID; Mouser Part Number: 595-INA826AID; Mouser Price/Stock: https://www.mouser.com/Search/Refine.aspx?Keyword=595-INA826AID; RS Part Number: 9212892; RS Price/Stock: https://uk.rs-online.com/web/p/products/9212892
AN_BUFFER = MCP6024-E_SL: Integrated Circuit; Manufacturer_Name: Microchip; Manufacturer_Part_Number: MCP6024-E/SL; Allied_Number: 70414688; Datasheet Link: http://docs-emea.rs-online.com/webdocs/0d05/0900766b80d05ae9.pdf; Height: 1.75mm; Mouser Part Number: 579-MCP6024-E/SL; Mouser Price/Stock: https://www.mouser.com/Search/Refine.aspx?Keyword=579-MCP6024-E%2FSL; RS Part Number: 1460161; RS Price/Stock: http://uk.rs-online.com/web/p/products/1460161; Allied Price/Stock: http://www.alliedelec.com/microchip-technology-inc-mcp6024-e-sl/70414688/
C1 C2 C5 C8-C57 C59 C60 = C2012X5R1H224K125AA: Cap Ceramic 0.22uF 50V X5R 10% SMD 0805 85Â°C Blister Plastic T/R; MF: TDK; Digi-Key_Purchase_URL: https://www.digikey.pt/product-detail/en/tdk-corporation/C2012X5R1H224K125AA/445-14405-1-ND/3956071?utm_source=snapeda&utm_medium=aggregator&utm_campaign=symbol; Digi-Key_Part_Number: 445-14405-1-ND; MP: C2012X5R1H224K125AA; Package: 0805 TDK; SnapEDA_Link: https://www.snapeda.com/parts/C2012X5R1H224K125AA/TDK/view-part/?ref=snap; Value: *
C3 C4 C6 C7 C61-C68 = 12061A122FAT2A: 1206YC104MAT2A; MF: AVX; Package: 1206 AVX; Availability: Unavailable; SnapEDA_Link: https://www.snapeda.com/parts/12061A122FAT2A/AVX/view-part/?ref=snap; MP: 12061A122FAT2A; Price: None; Value: *
C69 C70 C73 C74 = C2012X5R1H224K125AA: 4.7uF/50V; MF: TDK; Digi-Key_Purchase_URL: https://www.digikey.pt/product-detail/en/tdk-corporation/C2012X5R1H224K125AA/445-14405-1-ND/3956071?utm_source=snapeda&utm_medium=aggregator&utm_campaign=symbol; Digi-Key_Part_Number: 445-14405-1-ND; MP: C2012X5R1H224K125AA; Package: 0805 TDK; SnapEDA_Link: https://www.snapeda.com/parts/C2012X5R1H224K125AA/TDK/view-part/?ref=snap; Value: *
C71 C72 = C2012X5R1H224K125AA: 22uF/10V; MF: TDK; Digi-Key_Purchase_URL: https://www.digikey.pt/product-detail/en/tdk-corporation/C2012X5R1H224K125AA/445-14405-1-ND/3956071?utm_source=snapeda&utm_medium=aggregator&utm_campaign=symbol; Digi-Key_Part_Number: 445-14405-1-ND; MP: C2012X5R1H224K125AA; Package: 0805 TDK; SnapEDA_Link: https://www.snapeda.com/parts/C2012X5R1H224K125AA/TDK/view-part/?ref=snap; Value: *
CAN_TRANSC_0 CAN_TRANSC_1 = ISO1050DUB: Isolated 5-V CAN Transceivers 8-SOP -55 to 105; MF: Texas Instruments; Price: None; Package: SOP-8 Texas Instruments; Availability: Unavailable; MP: ISO1050DUB; SnapEDA_Link: https://www.snapeda.com/parts/ISO1050DUB/Texas%20Instruments/view-part/?ref=snap; Value: *
CAN_TRANSC_2 = TCAN332GD: No Description Available; Vendor: Texas Instruments; Built_By: EMA_UL_Team; Manufacturer_Part_Number: TCAN332GD; Copyright: Copyright (C) 2018 Accelerated Designs. All rights reserved; RefDes: RefDes; Type: DEV; Value: Value
CONTROLLER_2 = MCP2517FD-H_SL: Integrated Circuit; Manufacturer_Name: Microchip; Manufacturer_Part_Number: MCP2517FD-H/SL; Datasheet Link: https://componentsearchengine.com/Datasheets/2/MCP2517FD-H_SL.pdf; Height: 1.75mm; Mouser Part Number: 579-MCP2517FD-H/SL; Mouser Price/Stock: https://www.mouser.com/Search/Refine.aspx?Keyword=579-MCP2517FD-H%2FSL; RS Part Number: 1793997; RS Price/Stock: https://uk.rs-online.com/web/p/products/1793997
D1 D2 = S5MC-13-F: No Description Available; Vendor: Diodes Inc; Built_By: EMA_UL_Team; Type: DEV; Manufacturer_Part_Number: S5MC-13-F; Copyright: Copyright (C) 2018 Accelerated Designs. All rights reserved; RefDes: RefDes; Value: Value
DZ1-DZ4 DZ9 DZ10 = 1SMA5918BT3G: Zener Diode; Manufacturer_Name: ON Semiconductor; Datasheet Link: https://componentsearchengine.com/Datasheets/1/1SMA5918BT3G.pdf; Height: 2.2mm; Mouser Part Number: 863-1SMA5918BT3G; Mouser Price/Stock: https://www.mouser.com/Search/Refine.aspx?Keyword=863-1SMA5918BT3G; Manufacturer_Part_Number: 1SMA5918BT3G
DZ5-DZ8 = 1SMA5913BT3G: Diode; Manufacturer_Name: ON Semiconductor; Datasheet Link: https://componentsearchengine.com/Datasheets/1/1SMA5913BT3G.pdf; Height: 2.2mm; Mouser Part Number: 863-1SMA5913BT3G; Mouser Price/Stock: https://www.mouser.com/Search/Refine.aspx?Keyword=863-1SMA5913BT3G; Manufacturer_Part_Number: 1SMA5913BT3G
ECU_CONNECTOR = 5810140011: Double Header 20 pin receptacle; MF: TE Connectivity; MP: DTM13-12PA-12PB-R008; Package: None; TE_purchase_URL: https://www.te.com/usa-en/product-DTM1312PA12PBR008.html?te_bu=Cor&te_type=disp&te_campaign=seda_glo_cor-seda-global-disp-prtnr-fy19-seda-model-bom-cta_sma-317_1&elqCampaignId=32493; Price: None; Availability: Unavailable; SnapEDA_Link: https://www.snapeda.com/parts/DTM13-12PA-12PB-R008/TE%20Connectivity%20Deutsch%20Connectors/view-part/?ref=snap; Value: *
EEPROM = AT24C512C-SSHD-T: Integrated Circuit; Manufacturer_Name: Microchip; Datasheet Link: http://www.atmel.com/images/atmel-8720-seeprom-at24c512c-datasheet.pdf; Height: 1.75mm; Manufacturer_Part_Number: AT24C512C-SSHD-T; Mouser Part Number: 556-AT24C512C-SSHD-T; Mouser Price/Stock: https://www.mouser.com/Search/Refine.aspx?Keyword=556-AT24C512C-SSHD-T
ERASE RESET = 5-1437565-0: Switch Tactile OFF _ON_ Round Button Gull Wing 0.05A 12VDC 1.57N SMD T/R; MF: TE Connectivity; Price: None; EU_RoHS_Compliance: Compliant; Availability: Unavailable; Link: http://www.te.com/usa-en/product-5-1437565-0.html; SnapEDA_Link: https://www.snapeda.com/parts/5-1437565-0/TE%20Connectivity/view-part/?ref=snap; MP: 5-1437565-0; Package: None; Value: *
F1 = MF-MSMF050-2: Fuse; Manufacturer_Name: Bourns; Allied_Number: 70153466; Datasheet Link: https://www.bourns.com/pdfs/mfmsmf.pdf; Height: 0.85mm; Manufacturer_Part_Number: MF-MSMF050-2; Mouser Part Number: 652-MF-MSMF050-2; Mouser Price/Stock: https://www.mouser.com/Search/Refine.aspx?Keyword=652-MF-MSMF050-2; RS Part Number: 6478156P; RS Price/Stock: http://uk.rs-online.com/web/p/products/6478156P; Allied Price/Stock: https://www.alliedelec.com/bourns-mf-msmf050-2/70153466/
J1 J2 = 5-146274-2: 03 MODII HDR SRST B/A .100CL; Centerline_Pitch: 2.54 mm[.1 in]; MF: TE Connectivity; Number_of_Positions: 3; MP: 5-146274-3; Product_Type: Connector; Availability: Unavailable; Price: None; EU_RoHS_Compliance: Compliant; SnapEDA_Link: https://www.snapeda.com/parts/5-146274-3/TE%20Connectivity/view-part/?ref=snap; Link: http://www.te.com/usa-en/product-5-146274-3.html; Package: None; Value: *
L1-L4 = MH2029-300Y: Ferrite Bead; Manufacturer_Name: Bourns; Allied_Number: 71024701; Datasheet Link: http://www.mouser.com/ds/2/54/h-777565.pdf; Height: 1.3mm; Manufacturer_Part_Number: MH2029-300Y; Mouser Part Number: 652-MH2029-300Y; Mouser Price/Stock: https://www.mouser.com/Search/Refine.aspx?Keyword=652-MH2029-300Y; RS Part Number: 1814464; RS Price/Stock: http://uk.rs-online.com/web/p/products/1814464; Allied Price/Stock: https://www.alliedelec.com/bourns-mh2029-300y/71024701/
L5 = SDR0302-6R8ML: No Description Available; Vendor: Bourns Electronics; Built_By: EMA_UL_Team; Manufacturer_Part_Number: SDR0302-6R8ML; Copyright: Copyright (C) 2018 Accelerated Designs. All rights reserved; Value: Value
M1-M4 = BSS138: Integrated Circuit; Manufacturer_Name: Fairchild Semiconductor; Datasheet Link: http://docs-emea.rs-online.com/webdocs/0d22/0900766b80d22ec5.pdf; Height: 1.2mm; Manufacturer_Part_Number: BSS138; Mouser Part Number: 512-BSS138; Mouser Price/Stock: https://www.mouser.com/Search/Refine.aspx?Keyword=512-BSS138; RS Part Number: 1241694; RS Price/Stock: http://uk.rs-online.com/web/p/products/1241694
M5 = NVD5C454NT4G: MOSFET (N-Channel); Manufacturer_Name: ON Semiconductor; Datasheet Link: http://www.onsemi.com/pub/Collateral/NVD5C454N-D.PDF; Manufacturer_Part_Number: NVD5C454NT4G; Mouser Part Number: 863-NVD5C454NT4G; Mouser Price/Stock: https://www.mouser.com/Search/Refine.aspx?Keyword=863-NVD5C454NT4G; RS Part Number: 1784640; RS Price/Stock: https://uk.rs-online.com/web/p/products/1784640
M6 = HS_MOSFET: NVD5117PLT4G-VF01 / P CHANNEL; Manufacturer_Name: ON Semiconductor; Manufacturer_Part_Number: NVF6P02T3G; Allied_Number: 70467580; Datasheet Link: http://www.onsemi.com/pub/Collateral/NTF6P02T3-D.PDF; Height: 1.75mm; Mouser Part Number: 863-NVF6P02T3G; Mouser Price/Stock: https://www.mouser.com/Search/Refine.aspx?Keyword=863-NVF6P02T3G; RS Part Number: 8051996P; RS Price/Stock: http://uk.rs-online.com/web/p/products/8051996P; Allied Price/Stock: http://www.alliedelec.com/on-semiconductor-nvf6p02t3g/70467580/
MOSFET_ISO = VOD205T: VOD205 Series Dual Channel 70V 4000Vrms SMT Phototransistor Optocoupler - SOIC-8; MF: Vishay Semiconductor; MP: VOD205T; Digi-Key_Purchase_URL: https://www.digikey.com/product-detail/en/vishay-semiconductor-opto-division/VOD205T/VOD205TCT-ND/7612328?utm_source=snapeda&utm_medium=aggregator&utm_campaign=symbol; SnapEDA_Link: https://www.snapeda.com/parts/VOD205T/Vishay%20Semiconductor%20Opto%20Division/view-part/?ref=snap; Package: SOIC-8 Vishay; Digi-Key_Part_Number: VOD205TCT-ND; Value: *
PROFET_1-PROFET_4 = LM2576D2TR4-5G: Conv DC-DC Single Inv/Step Down 7V to 40V 6-Pin_5+Tab_ D2PAK T/R; MF: ON Semiconductor; Availability: Unavailable; SnapEDA_Link: https://www.snapeda.com/parts/LM2576D2TR4-5G/ON%20Semiconductor/view-part/?ref=snap; Price: None; Package: D2PAK ON Semiconductor; MP: LM2576D2TR4-5G; Value: *
R1-R62 = 1625873-5: RS 0805 RESISTOR KIT; MF: TE Connectivity; Price: None; MP: 1625873-5; Availability: Unavailable; SnapEDA_Link: https://www.snapeda.com/parts/1625873-5/TE%20Connectivity/view-part/?ref=snap; EU_RoHS_Compliance: Compliant with Exemptions; TE_purchase_URL: https://www.te.com/usa-en/product-1625873-5.html?te_bu=Cor&te_type=disp&te_campaign=seda_glo_cor-seda-global-disp-prtnr-fy19-seda-model-bom-cta_sma-317_1&elqCampaignId=32493; Package: 0805; Value: *
RV1 RV2 = CG0603MLC-05E: Varistor; Manufacturer_Name: Bourns; Allied_Number: 70153503; Datasheet Link: http://www.farnell.com/datasheets/1785244.pdf; Height: 0.55mm; Manufacturer_Part_Number: CG0603MLC-05E; Mouser Part Number: 652-CG0603MLC-05E; Mouser Price/Stock: https://www.mouser.com/Search/Refine.aspx?Keyword=652-CG0603MLC-05E; RS Part Number: 1814489; RS Price/Stock: http://uk.rs-online.com/web/p/products/1814489; Allied Price/Stock: https://www.alliedelec.com/bourns-cg0603mlc-05e/70153503/
SERIAL_ISO = MAX12931FASA+: Undefined or Miscellaneous; Manufacturer_Name: Maxim Integrated; Manufacturer_Part_Number: MAX12931BASA+; Datasheet Link: https://componentsearchengine.com/Datasheets/1/MAX12931BASA+.pdf; Height: 1.75mm; Mouser Part Number: 700-MAX12931BASA+; Mouser Price/Stock: https://www.mouser.com/Search/Refine.aspx?Keyword=700-MAX12931BASA%2B; RS Part Number: 1645076; RS Price/Stock: http://uk.rs-online.com/web/p/products/1645076
uC = ATSAM3X8EA-AU: Integrated Circuit; Manufacturer_Name: Microchip; Datasheet Link: http://www.mouser.com/ds/2/36/doc11057s-74756.pdf; Height: 1.6mm; Manufacturer_Part_Number: ATSAM3X8EA-AU; Mouser Part Number: 556-ATSAM3X8EA-AU; Mouser Price/Stock: https://www.mouser.com/Search/Refine.aspx?Keyword=556-ATSAM3X8EA-AU; RS Part Number: 1311191P; RS Price/Stock: http://uk.rs-online.com/web/p/products/1311191P
USB = 1734035-4: Connector; Manufacturer_Name: TE Connectivity; Datasheet Link: http://www.te.com/commerce/DocumentDelivery/DDEController?Action=srchrtrv&DocNm=1734035&DocType=Customer+Drawing&DocLang=English&DocFormat=pdf&PartCntxt=1734035-4; Manufacturer_Part_Number: 1734035-4; Mouser Part Number: 571-1734035-4; Mouser Price/Stock: https://www.mouser.com/Search/Refine.aspx?Keyword=571-1734035-4
V._REGULATOR_3V3 = PDS1-S5-S3-S: PDS1 Series 1 W 3.3 VDC 303 mA Single Output DC-DC Isolated Converter; MF: CUI Inc.; CUI_purchase_URL: https://www.cui.com/product/power/dc-dc-converters/isolated/pds1-s-series?utm_source=snapeda.com&utm_medium=referral&utm_campaign=snapedaBOM; SnapEDA_Link: https://www.snapeda.com/parts/PDS1-S5-S3-S/CUI%20Inc./view-part/?ref=snap; Digi-Key_Purchase_URL: https://www.digikey.com/product-detail/en/cui-inc/PDS1-S5-S3-S/102-2756-ND/4009680?utm_source=snapeda&utm_medium=aggregator&utm_campaign=symbol; MP: PDS1-S5-S3-S; Package: SIP-4 CUI; Digi-Key_Part_Number: 102-2756-ND; Value: *
Y1 = ECS-120-12-33Q-JES-TR: AEC-Q200 qualified, Crystal, Ceramic Seam Seal, 12.000MHZ, 12pf, 20ppm @ 25C, 50ppm -40+125C, 3.2 x 2.5 x 0.8mm; MF: ECS Inc.; Digi-Key_Purchase_URL: https://www.digikey.pt/product-detail/en/ecs-inc/ECS-120-12-33Q-JES-TR/XC2143CT-ND/6050972?utm_source=snapeda&utm_medium=aggregator&utm_campaign=symbol; Digi-Key_Part_Number: XC2143CT-ND; SnapEDA_Link: https://www.snapeda.com/parts/ECS-120-12-33Q-JES-TR/ECS%20Inc./view-part/?ref=snap; Package: SMD-4 ECS International; MP: ECS-120-12-33Q-JES-TR; Value: *
Y2 = ECS-.327-9-39-TR: 32.768kHz 20ppm Crystal 9pF 70 kOhm -40C ~ 85C Surface Mount 2-SMD, No Lead 4.9 x 1.8; MF: ECS International; Digi-Key_Purchase_URL: https://www.digikey.pt/product-detail/en/ecs-inc/ECS-.327-9-39-TR/XC2299CT-ND/6821667?utm_source=snapeda&utm_medium=aggregator&utm_campaign=symbol; Digi-Key_Part_Number: XC2299CT-ND; SnapEDA_Link: https://www.snapeda.com/parts/ECS-.327-9-39-TR/ECS%20Inc./view-part/?ref=snap; Package: SMD-2 ECS International; MP: ECS-.327-9-39-TR; Value: *
Y3 = ECS-080-18-23G-JGN-TR: ECS-200-20-23A-EN-TR / 20MHz; MF: ECS International; Price: None; Availability: Unavailable; SnapEDA_Link: https://www.snapeda.com/parts/ECS-080-18-23G-JGN-TR/ECS%20Inc./view-part/?ref=snap; MP: ECS-080-18-23G-JGN-TR; Package: SMD-2 ECS International; Value: *
V._REGULATOR_5V = P78E05-1000: Value: *